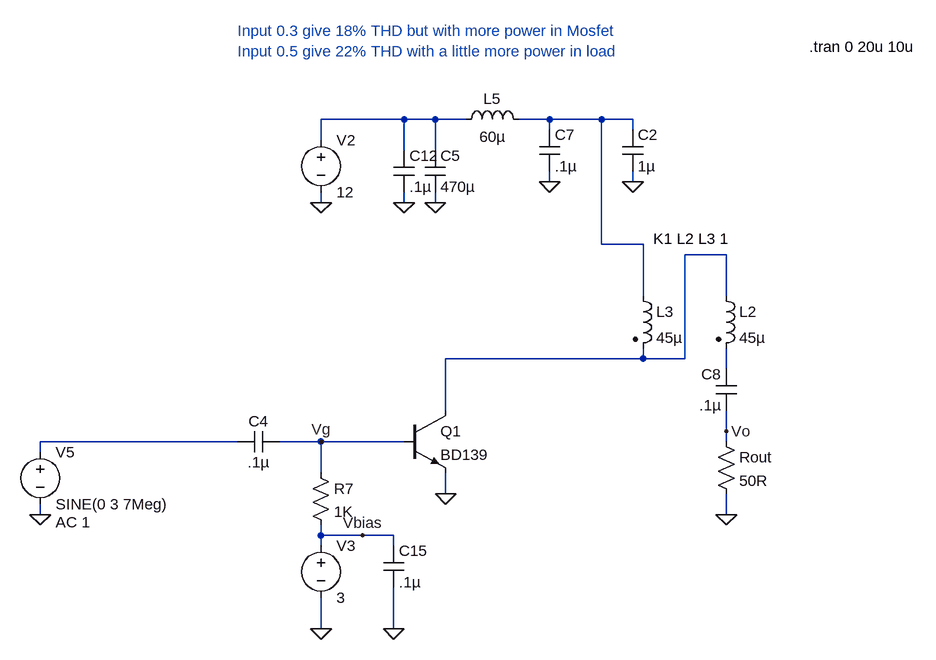
[diagram p0: schematic BD139 Testing Power Amp.asc]
BD139 Testing Power Amp.asc, the LTspice schematic file:
Version 4
SHEET 1 3060 1616
WIRE 1072 -400 944 -400
WIRE 1120 -400 1072 -400
WIRE 1168 -400 1120 -400
WIRE 1296 -400 1248 -400
WIRE 1376 -400 1296 -400
WIRE 1424 -400 1376 -400
WIRE 1296 -384 1296 -400
WIRE 1424 -384 1424 -400
WIRE 944 -368 944 -400
WIRE 1072 -352 1072 -400
WIRE 1120 -352 1120 -400
WIRE 1296 -304 1296 -320
WIRE 1424 -304 1424 -320
WIRE 944 -272 944 -288
WIRE 1072 -272 1072 -288
WIRE 1120 -272 1120 -288
WIRE 1376 -208 1376 -400
WIRE 1440 -208 1376 -208
WIRE 1568 -192 1504 -192
WIRE 1440 -128 1440 -208
WIRE 1568 -128 1568 -192
WIRE 1440 -32 1440 -48
WIRE 1440 -32 1136 -32
WIRE 1504 -32 1504 -192
WIRE 1504 -32 1440 -32
WIRE 1568 -16 1568 -48
WIRE 1136 48 1136 -32
WIRE 1568 80 1568 48
WIRE 816 96 512 96
WIRE 944 96 880 96
WIRE 1072 96 944 96
WIRE 1568 96 1568 80
WIRE 512 112 512 96
WIRE 944 144 944 96
WIRE 1136 176 1136 144
WIRE 512 208 512 192
WIRE 1568 208 1568 176
WIRE 944 240 944 224
WIRE 1008 240 944 240
WIRE 1056 240 1008 240
WIRE 944 256 944 240
WIRE 1056 256 1056 240
WIRE 944 384 944 336
WIRE 1056 384 1056 320
FLAG 944 -272 0
FLAG 944 384 0
FLAG 1136 176 0
FLAG 1120 -272 0
FLAG 1296 -304 0
FLAG 1424 -304 0
FLAG 1072 -272 0
FLAG 1568 208 0
FLAG 1568 80 Vo
FLAG 1056 384 0
FLAG 944 96 Vg
FLAG 1008 240 Vbias
FLAG 512 208 0
SYMBOL voltage 944 -384 R0
WINDOW 123 0 0 Left 2
WINDOW 39 0 0 Left 2
SYMATTR InstName V2
SYMATTR Value 12
SYMBOL cap 880 80 R90
WINDOW 0 0 32 VBottom 2
WINDOW 3 32 32 VTop 2
SYMATTR InstName C4
SYMATTR Value .1µ
SYMBOL voltage 944 240 R0
WINDOW 123 0 0 Left 2
WINDOW 39 0 0 Left 2
SYMATTR InstName V3
SYMATTR Value 3
SYMBOL res 928 128 R0
SYMATTR InstName R7
SYMATTR Value 1K
SYMBOL ind 1152 -384 R270
WINDOW 0 32 56 VTop 2
WINDOW 3 5 56 VBottom 2
SYMATTR InstName L5
SYMATTR Value 60µ
SYMBOL cap 1104 -352 R0
SYMATTR InstName C5
SYMATTR Value 470µ
SYMBOL cap 1280 -384 R0
SYMATTR InstName C7
SYMATTR Value .1µ
SYMBOL cap 1584 48 R180
WINDOW 0 24 56 Left 2
WINDOW 3 24 8 Left 2
SYMATTR InstName C8
SYMATTR Value .1µ
SYMBOL ind2 1552 -144 R0
SYMATTR InstName L2
SYMATTR Value 45µ
SYMATTR Type ind
SYMBOL cap 1408 -384 R0
SYMATTR InstName C2
SYMATTR Value 1µ
SYMBOL cap 1056 -352 R0
SYMATTR InstName C12
SYMATTR Value .1µ
SYMBOL res 1552 80 R0
SYMATTR InstName Rout
SYMATTR Value 50R
SYMBOL cap 1040 256 R0
SYMATTR InstName C15
SYMATTR Value .1µ
SYMBOL voltage 512 96 R0
WINDOW 123 24 124 Left 2
WINDOW 39 0 0 Left 2
SYMATTR Value2 AC 1
SYMATTR InstName V5
SYMATTR Value SINE(0 3 7Meg)
SYMBOL ind2 1424 -144 R0
SYMATTR InstName L3
SYMATTR Value 45µ
SYMATTR Type ind
SYMBOL npn 1072 48 R0
SYMATTR InstName Q1
SYMATTR Value BD139
TEXT 1456 -216 Left 2 !K1 L2 L3 1
TEXT 1696 -512 Left 2 !.tran 0 20u 10u
TEXT 816 -536 Left 2 ;Input 0.3 give 18% THD but with more power in Mosfet\nInput 0.5 give 22% THD with a little more power in load

The netlist it stands for:
* BD139 Testing Power Amp.asc
V2 N001 0 12
C4 Vg N005 .1µ
V3 Vbias 0 3
R7 Vg Vbias 1K
L5 N001 N002 60µ
C5 N001 0 470µ
C7 N002 0 .1µ
C8 Vo N004 .1µ
L2 N003 N004 45µ
C2 N002 0 1µ
C12 N001 0 .1µ
Rout Vo 0 50R
C15 Vbias 0 .1µ
V5 N005 0 SINE(0 3 7Meg) AC 1
L3 N002 N003 45µ
Q1 N003 Vg 0 0 BD139
.model NPN NPN
.model PNP PNP
.lib standard.bjt
K1 L2 L3 1
.tran 0 20u 10u
* Input 0.3 give 18% THD but with more power in Mosfet
* Input 0.5 give 22% THD with a little more power in load
.backanno
.end